# Altium schematic sheet HV Sense.SchDoc
size A4
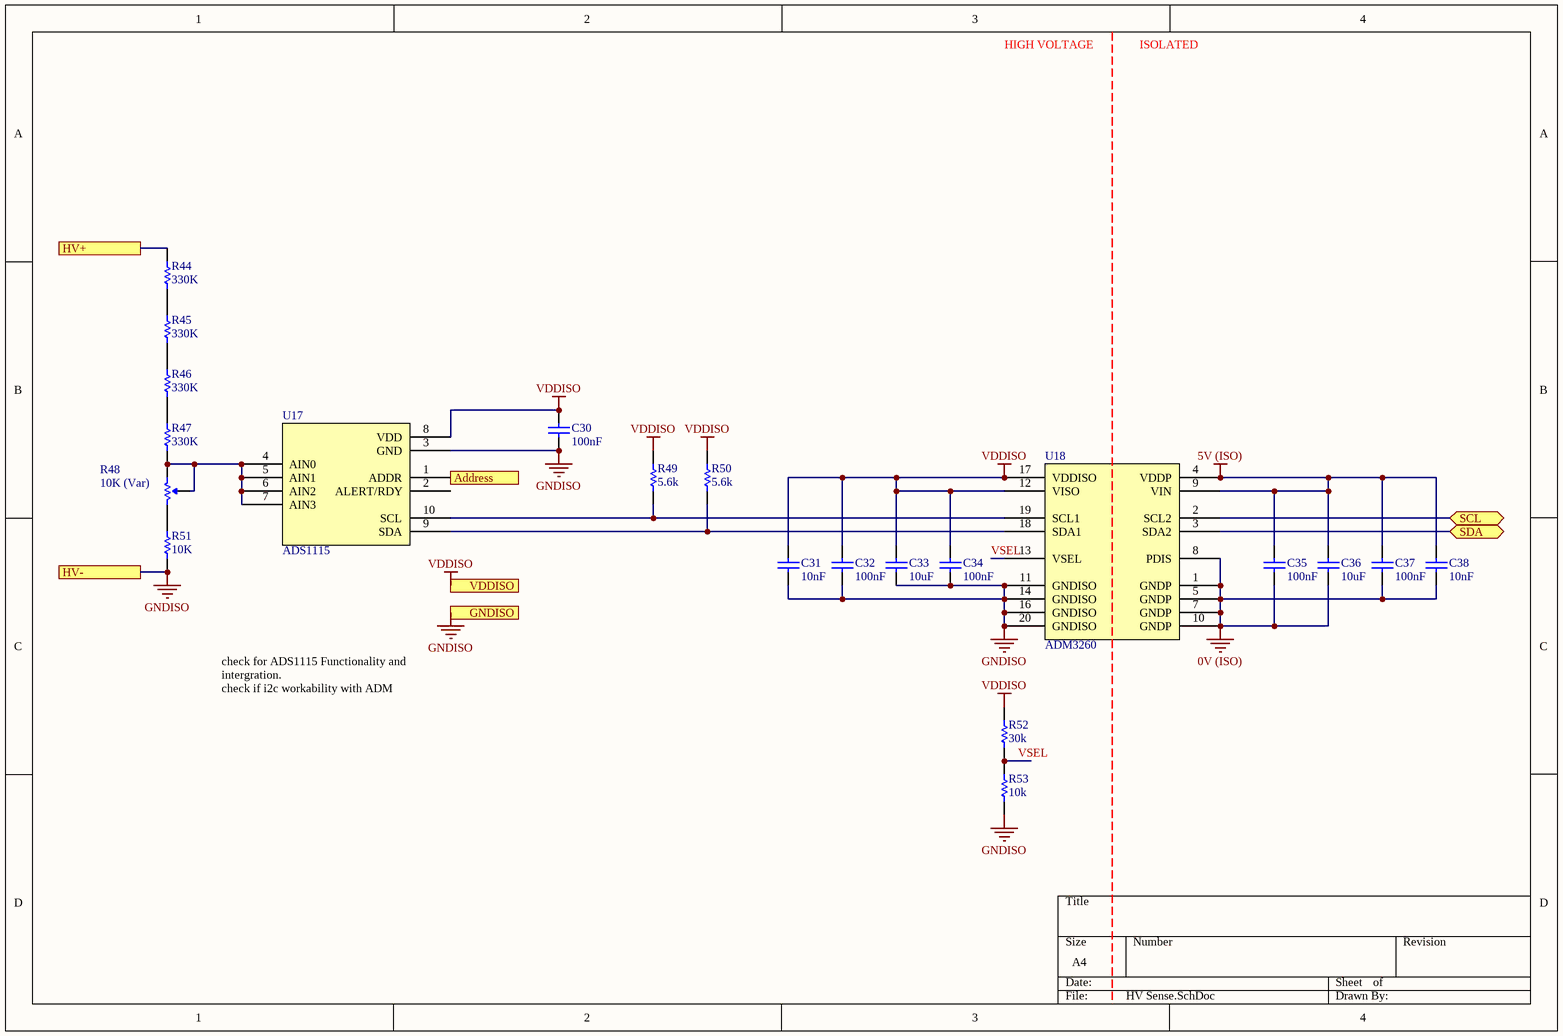
[diagram p0: HV Sense.SchDoc]

## Parts
C30  100nF  [0805]
C31  10nF  [0805]
C32  100nF  [0805]
C33  10uF  [0805]
C34  100nF  [0805]
C35  100nF  [0805]
C36  10uF  [0805]
C37  100nF  [0805]
C38  10nF  [0805]
R44  330K  [VB 0204]
R45  330K  [VB 0204]
R46  330K  [VB 0204]
R47  330K  [VB 0204]
R48  10K (Var)  [B 3296]
R49  5.6k  [0805]
R50  5.6k  [0805]
R51  10K  [VB 0204]
R52  30k  [0805]
R53  10k  [0805]
U17  ADS1115  [TI 10-VSSOP]
U18  ADM3260  [AD 20-SSOP]

## Ports
Address, GNDISO, HV+, HV-, SCL (bidir), SDA (bidir), VDDISO

## Nets
0V (ISO): C35.1 C36.1 C37.1 C38.1 U18.1(GNDP) U18.5(GNDP) U18.7(GNDP) U18.8(PDIS) U18.10(GNDP)
5V (ISO): C35.2 C36.2 C37.2 C38.2 U18.4(VDDP) U18.9(VIN)
GNDISO: C30.2 C31.1 C32.1 C33.1 C34.2 R51.1 R53.1 U17.3(GND) U18.11(GNDISO) U18.14(GNDISO) U18.16(GNDISO) U18.20(GNDISO) ; port HV-, port GNDISO
VDDISO: C30.1 C31.2 C32.2 C33.2 C34.1 R49.2 R50.2 R52.2 U17.8(VDD) U18.12(VISO) U18.17(VDDISO) ; port VDDISO
Address: U17.1(ADDR) ; port Address
HV+: R44.2 ; port HV+
SCL: U18.2(SCL2) ; port SCL
SDA: U18.3(SDA2) ; port SDA
VSEL: R52.1 R53.2 U18.13(VSEL)
NetR44_1: R44.1 R45.2
NetR45_1: R45.1 R46.2
NetR46_1: R46.1 R47.2
NetR47_1: R47.1 R48.2(Wiper) R48.3(CW) U17.4(AIN0) U17.5(AIN1) U17.6(AIN2) U17.7(AIN3)
NetR48_1: R48.1(CCW) R51.2
NetR49_1: R49.1 U17.10(SCL) U18.19(SCL1)
NetR50_1: R50.1 U17.9(SDA) U18.18(SDA1)

Not connected (* = marked no-connect by the designer): U17 2(ALERT/RDY)

## Notes on the sheet
- HIGH VOLTAGE
- ISOLATED
- check for ADS1115 Functionality and intergration.
  check if i2c workability with ADM

## Library data of the parts
C30 C32 C34 C35 C37 = GCM21BR71H104KA37L: Manufacturer: muRata; Tolerance: ±10%; Material: X7R; Rated Voltage: 50V; Part Number: GCM21BR71H104KA37L; Value: 100nF; Digikey Part Number: 490-6064-1-ND
C31 C38 = GCM2195C1H103JA16D: Manufacturer: muRata; Tolerance: ±5%; Material: C0G, NP0; Rated Voltage: 50V; Part Number: GCM2195C1H103JA16D; Value: 10nF; Digikey Part Number: 490-4783-1-ND
C33 C36 = GRM21BR6YA106KE43L: Manufacturer: muRata; Tolerance: 10%; Material: X5R; Rated Voltage: 50V; Part Number: GRM21BR6YA106KE43L; Value: 10uF; Digikey Part Number: 490-10514-6-ND
R44-R47 = MMA02040C3303FB300: Manufacturer: Vishay Beyschlag; Tolerance: 0.01; Rated Voltage: 0.4W; Part Number: MMA02040C3303FB300; Value: 330K; Digikey Part Number: MMA-330KACT-ND
R48 = 3296W-1-103LF: Manufacturer: Bournes Inc; Tolerance: 0.1; Rated Voltage: 0.5W; Part Number: 3296W-1-103LF; Value: 10K (Var); Digikey Part Number: 3296W-103LF-ND
R49 R50 = RC0805FR075K6L: Manufacturer: YAGEO; Tolerance: 0.01; Rated Voltage: 0.125W; Part Number: RC0805FR075K6L; Value: 5.6k; Material: FR-07; Digikey Part Number: 311-5.60KCRCT-ND
R51 = MMA02040C1002FB300: Manufacturer: Vishay Beyschlag; Tolerance: 0.01; Rated Voltage: 0.4W; Part Number: MMA02040C1002FB300; Value: 10K; Digikey Part Number: MMA-10KACT-ND
R52 = RC0805FR0730KL: Manufacturer: YAGEO; Tolerance: 0.01; Rated Voltage: 0.125W; Part Number: RC0805FR0730KL; Value: 30k; Material: FR-07; Digikey Part Number: 311-30.0KCRCT-ND
R53 = RC0805FR0710KL: Manufacturer: YAGEO; Tolerance: 0.01; Rated Voltage: 0.125W; Part Number: RC0805FR0710KL; Value: 10k; Material: FR-07; Digikey Part Number: 311-10.0KCRCT-ND
U17 = ADS1115: 16 Bit Analog to Digital Converter 2, 4 Input 1 Sigma-Delta 10-VSSOP; Manufacturer: Texas Instruments; Part Number: ADS1115; Digikey Part Number: 296-38849-1-ND; Digikey Link: https://www.digikey.com/product-detail/en/texas-instruments/ADS1115IDGSR/296-38849-1-ND/5142969
U18 = ADM3260: I²C Digital Isolator 2500Vrms 2 Channel 25kV/µs CMTI 20-SSOP (0.209", 5.30mm Width); Manufacturer: Analog Devices; Part Number: ADM3260; Digikey Part Number: ADM3260ARSZ-RL7CT-ND; Digikey Link: https://www.digikey.com/product-detail/en/analog-devices-inc/ADM3260ARSZ-RL7/ADM3260ARSZ-RL7CT-ND/5233040